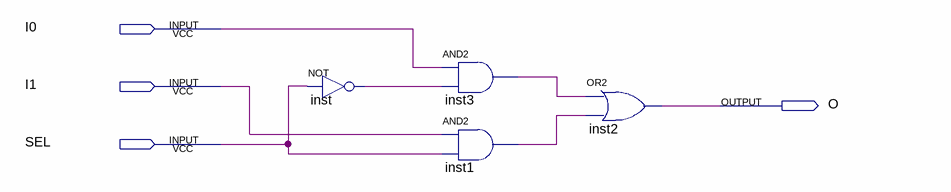
[diagram p0: schematic sheet]
// Quartus schematic 2_1_mux.bdf as structural Verilog: 4 symbols, 4 pins
module \2_1_mux  (
  input  I0,
  input  I1,
  input  SEL,
  output O
);

  wire inst1_out, inst3_out, inst_out;

  not inst (inst_out, SEL);
  and inst3 (inst3_out, I0, inst_out);
  and inst1 (inst1_out, I1, SEL);
  or inst2 (O, inst3_out, inst1_out);
endmodule
